# EasyEDA Pro project ProPrj_辉光管时钟-END_2025-01-18.epro

# Schematic Schematic1
Create Date: 2024-02-25; Page Name: P1; Project Name: 辉光管时钟-END; Schematic Name: Schematic1; Update Date: 2024-07-03; Company: 嘉立创EDA; Page Size: A4; Version: V1.0
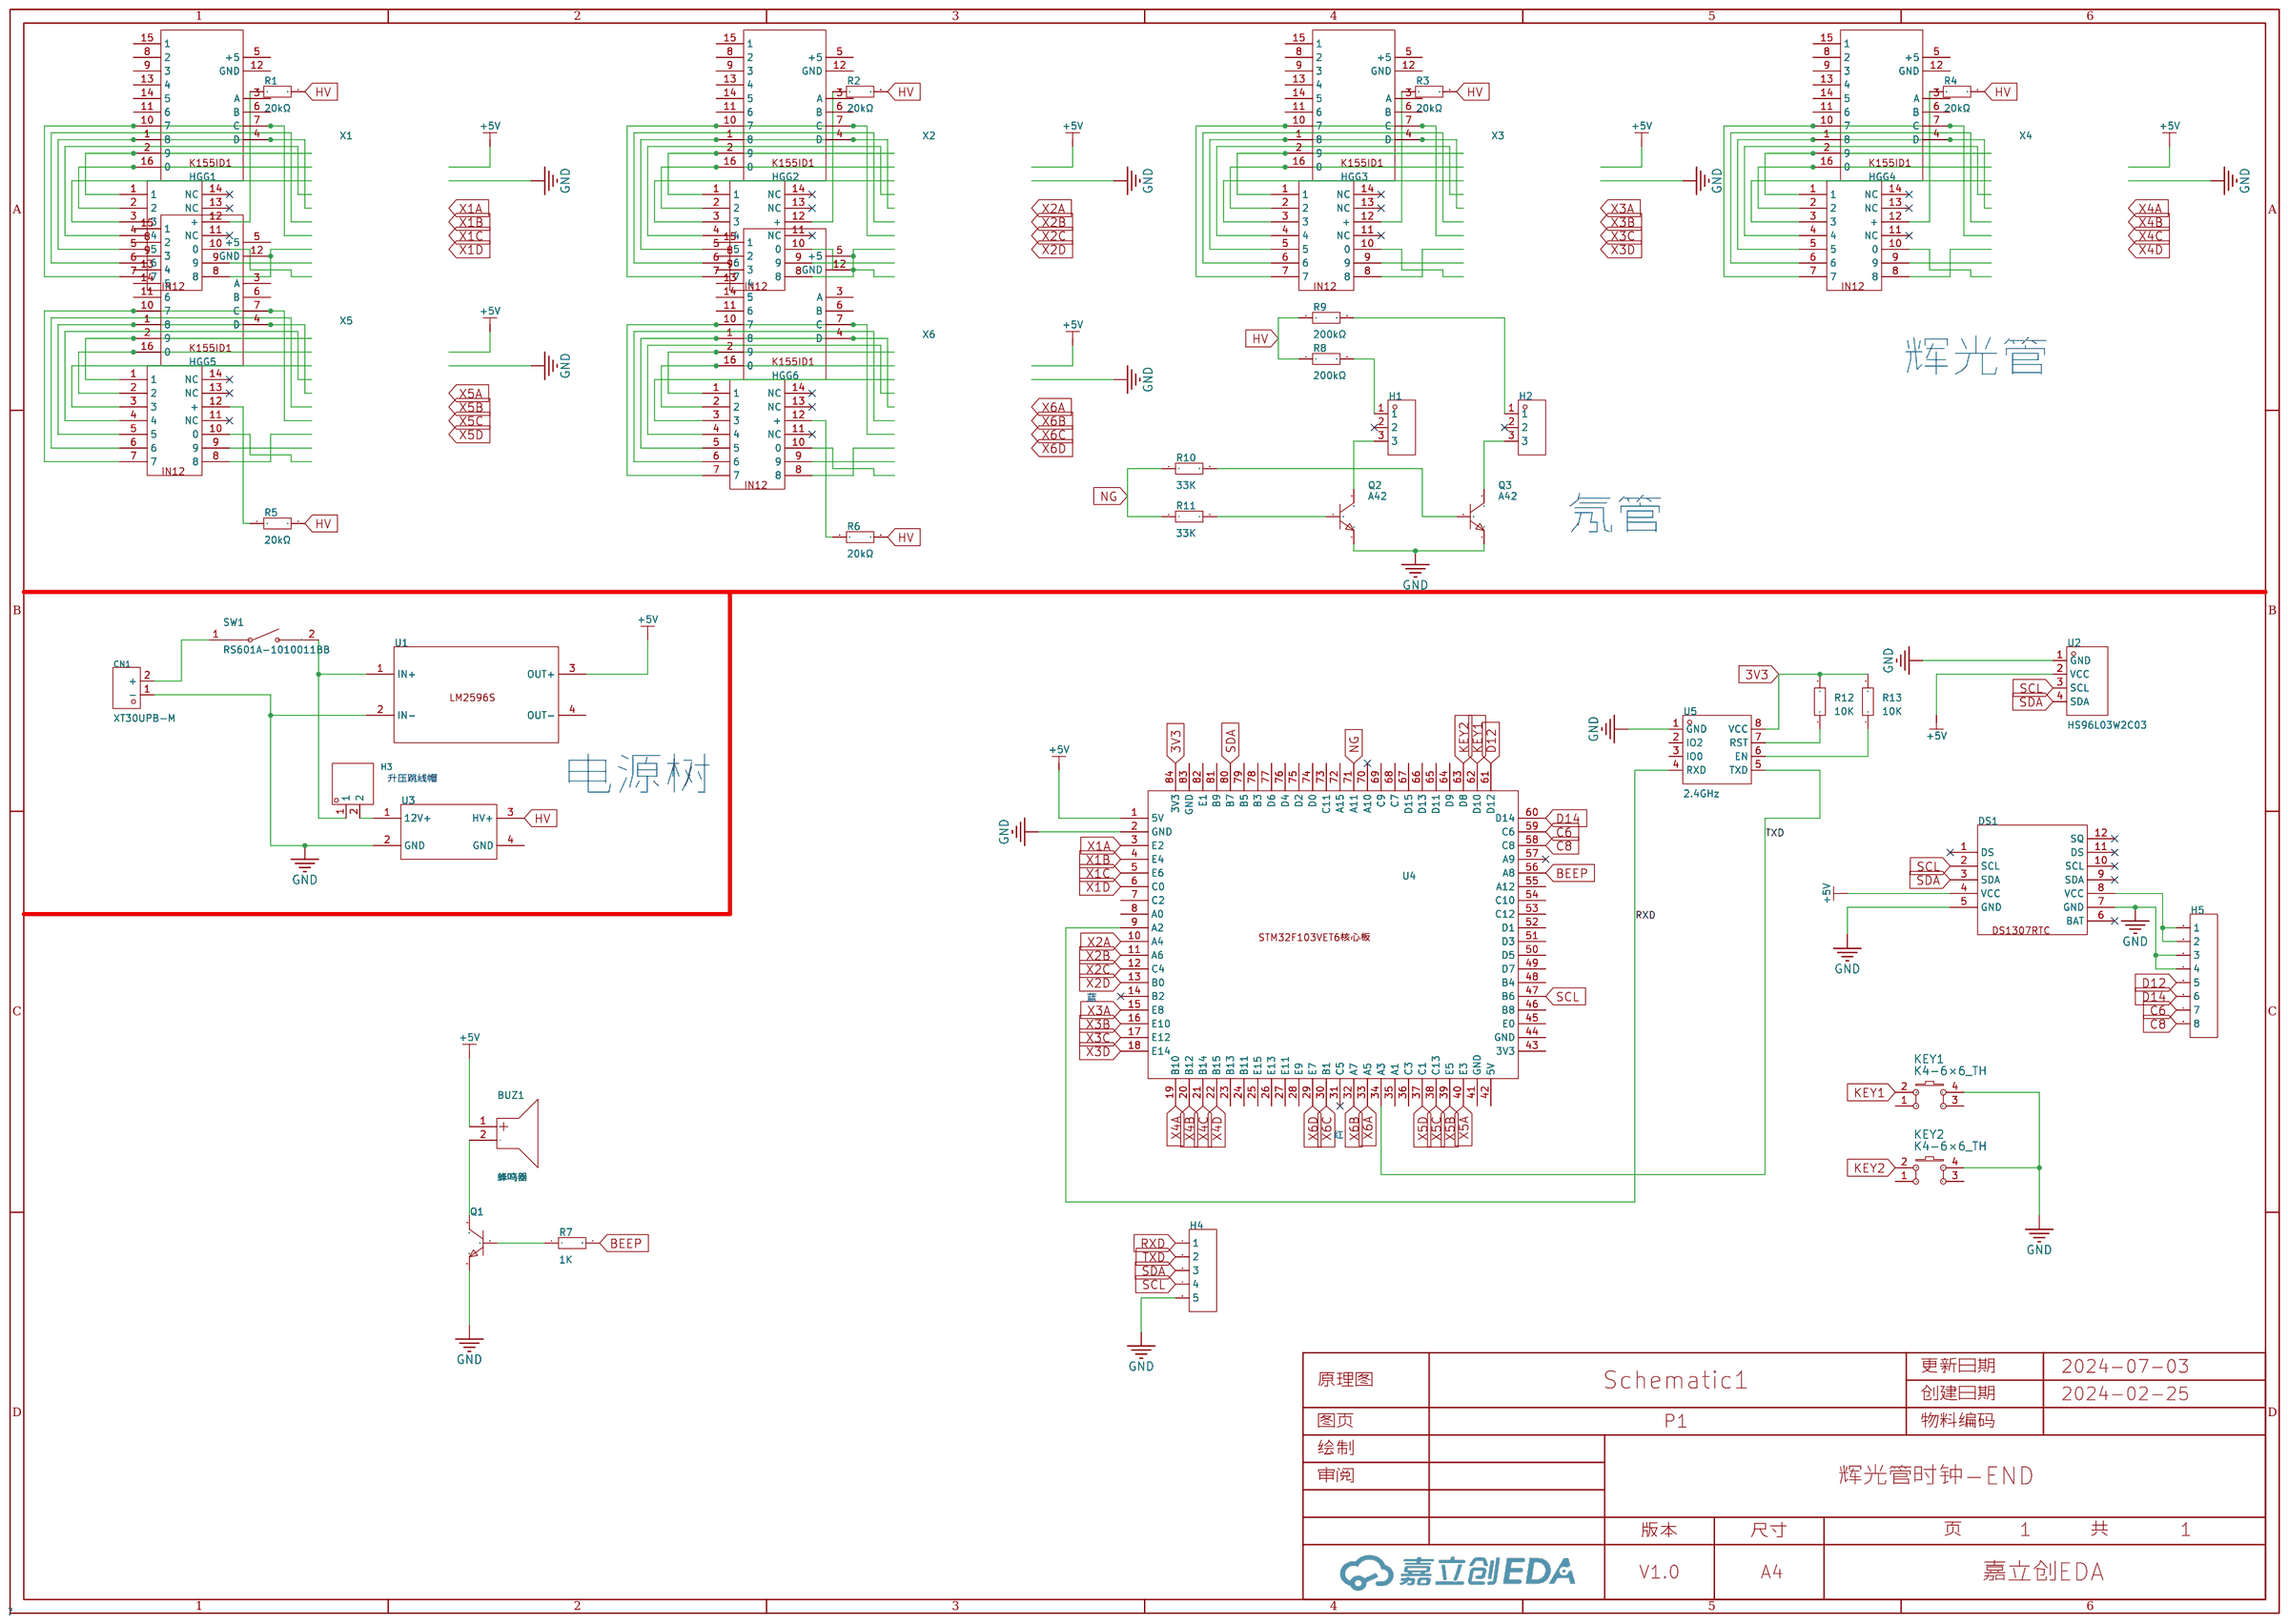
[diagram p0: schematic sheet]

## Parts
BUZ1  蜂鸣器  [BUZ-TH_BD9.0-P5.00-D0.6-FD]
CN1  XT30UPB-M  [CONN-TH_XT30UPB-M]
DS1  -  [Tiny RTC]
H1  -  [HDR-TH_3P-P2.54-V-F]
H2  -  [HDR-TH_3P-P2.54-V-F]
H3  -  [HDR-TH_2P-P2.54-V-M-1]
H4  -  [HDR-TH_5P-P2.54-V-F]
H5  -  [HDR-TH_8P-P2.54-V-F-1]
HGG1  -  [IN12-6]
HGG2  -  [IN12-6]
HGG3  -  [IN12-6]
HGG4  -  [IN12-6]
HGG5  -  [IN12-6]
HGG6  -  [IN12-6]
KEY1  K4-6×6_TH  [KEY-TH_4P-L6.0-W6.0-P4.50-LS6.5]
KEY2  K4-6×6_TH  [KEY-TH_4P-L6.0-W6.0-P4.50-LS6.5]
Q1  -  [S8050_SOT-23]
Q2  A42  [TO-92-3_L5.1-W4.1-P1.27-L]
Q3  A42  [TO-92-3_L5.1-W4.1-P1.27-L]
R1  20kΩ  [RES-TH_BD2.2-L6.5-P10.50-D0.6]
R2  20kΩ  [RES-TH_BD2.2-L6.5-P10.50-D0.6]
R3  20kΩ  [RES-TH_BD2.2-L6.5-P10.50-D0.6]
R4  20kΩ  [RES-TH_BD2.2-L6.5-P10.50-D0.6]
R5  20kΩ  [RES-TH_BD2.2-L6.5-P10.50-D0.6]
R6  20kΩ  [RES-TH_BD2.2-L6.5-P10.50-D0.6]
R7  1K  [R0805]
R8  200kΩ  [Res_1/4W]
R9  200kΩ  [Res_1/4W]
R10  33K  [R0805]
R11  33K  [R0805]
R12  10K  [R0805]
R13  10K  [R0805]
SW1  RS601A-1010011BB  [SW-TH_RS601A-1010011BB]
U1  -  [LM2596S降压模块]
U2  HS96L03W2C03  [OLED-TH_L27.8-W27.2-P2.54_C9900033791]
U3  -  [升压模块2]
U4  -  [魔女STM32F103VET6核心板]
U5  2.4GHz  [WIFIM-TH_8P-L24.7-W14.4-P2.54]
X1  -  [K155ID1]
X2  -  [K155ID1]
X3  -  [K155ID1]
X4  -  [K155ID1]
X5  -  [K155ID1]
X6  -  [K155ID1]

## Library data of the parts
BUZ1 = 蜂鸣器: Supplier Part: C9900020875; Supplier Footprint: 插件; JLCPCB Part Class: 扩展库; Supplier: LCSC
CN1 = XT30UPB-M: 类别:-;类型1:-;; LCSC Part Name: AMASS(艾迈斯)板载立式 航模锂电池控制器连接器插头 公头XT30UPB-M; Supplier Part: C428721; Manufacturer: AMASS(艾迈斯); JLCPCB Part Class: 扩展库; Datasheet: https://atta.szlcsc.com/upload/public/pdf/source/20230412/7B5DFEF57C9EA5273853390C734B3AC5.pdf; Supplier: LCSC; Brand: 艾迈斯; Type: 航模插头; Colour: 黄色; RatedVoltage: DC 500V; InterfaceType: 公头; MetalMaterial: 镀金; InsulationMaterial: PA; RatedCurrent: 15A; contact resistance: 0.65mΩ
DS1 = DS1307模块IIC: DS1307模块
H1 H2 = HDR-F_2.54_1x3P: Supplier Part: C541850; Supplier Footprint: 插件
H3 = HDR-M_2.54_1x2P: Supplier Part: C124375; Supplier Footprint: 插件
H4 = HDR-F_2.54_1x5P: Supplier Part: C50950; Supplier Footprint: 插件
H5 = HDR-F_2.54_1x8P: Supplier Part: C27438; Supplier Footprint: 插件
HGG1-HGG6 = 辉光管IN12
KEY1 KEY2 = K4-6×6_TH: link: https://item.szlcsc.com/111374.html; Supplier: LCSC; Supplier Part: C136684; Manufacturer: 韩国韩荣; Manufacturer Part: K2-1102DP-E4SW-04
Q1 = S8050_SOT_NPN: Supplier Footprint: SOT-23
Q2 Q3 = A42: 晶体管类型:NPN;集电极电流(Ic):200mA;集射极击穿电压(Vceo):305V;功率(Pd):625mW;直流电流增益(hFE@Ic,Vce):100@10mA,10V;; LCSC Part Name: A42(RANGE:100-200) B档（100-200）; Supplier Part: C28408; Manufacturer: CJ(江苏长电/长晶); Supplier Footprint: TO-92-3; JLCPCB Part Class: Extended Part; Datasheet: https://atta.szlcsc.com/upload/public/pdf/source/20151024/1457707487139.pdf; Supplier: LCSC; Transistor Type: NPN; Collector Current (Ic): 200mA; Collector-Emitter Breakdown Voltage (Vceo): 305V; Power Dissipation (Pd): 625mW; DC Current Gain (hFE@Ic,Vce): 100@10mA,10V; Transition Frequency (fT): 50MHz; Collector Cut-Off Current (Icbo): 250nA; Collector-Emitter Saturation Voltage (VCE(sat)@Ic,Ib): 200mV@20mA,2mA
R1-R6 = MFR0W4F2002A50: 电阻类型:金属膜电阻;阻值:20kΩ;精度:±1%;功率:250mW;温度系数:±50ppm/℃;; LCSC Part Name: 20kΩ ±1% 250mW 金属膜电阻; Supplier Part: C58594; Manufacturer: UNI-ROYAL(厚声); Supplier Footprint: 插件,D2.2xL6.5mm; JLCPCB Part Class: 扩展库; Datasheet: https://atta.szlcsc.com/upload/public/pdf/source/20191012/C436293_8820AA14BC71FA35E551C06C441482A0.pdf; Supplier: LCSC; Type: 金属膜电阻; Tolerance: ±1%; Overload Voltage (Max): 250V; Power(Watts): 250mW; Temperature Coefficient: ±50ppm/℃
R7 R10-R13 = Res_0805: Supplier Footprint: 0805
R8 R9 = Res_AXIAL-1/4W: Supplier Footprint: 轴向引线
SW1 = RS601A-1010011BB: Supplier Part: C883003; Manufacturer: LECI(乐磁); Supplier Footprint: 插件; JLCPCB Part Class: 扩展库; Datasheet: https://atta.szlcsc.com/upload/public/pdf/source/20201029/C883003_B485C30933EC2A673609346EE1934526.pdf; Supplier: LCSC
U1 = LM2569S降压模块
U2 = HS96L03W2C03: 主控芯片:SSD1315;接口类型:I2C;尺寸(inch):0.96;像素分辨率:128x64;; LCSC Part Name: 0.96寸OLED显示屏窄白光IIC; Supplier Part: C5248080; Manufacturer: HS(汉昇); JLCPCB Part Class: 扩展库; Datasheet: https://atta.szlcsc.com/upload/public/pdf/source/20230627/763D01F79A90007632F098068C7C8AD9.pdf; Supplier: LCSC; Main Control Chip: SSD1315; Interface Type: I2C; Size: 0.96; Pixel Resolution: 128x64; Operating Temperature: -40℃~+70℃
U3 = 辉光管升压模块: 给辉光管升压的模块
U4 = 魔女STM32F103VET6核心板
U5 = ESP-01S: 核心处理器:ESP8266芯片;频率:2.4GHz;天线形式:板载PCB天线;发射功率:16dBm;接收灵敏度:-90dBm;; LCSC Part Name: 完整的802.11b/g/nWi-FiSoC模块; Supplier Part: C503582; Manufacturer: Ai-Thinker(安信可); JLCPCB Part Class: 扩展库; Datasheet: https://atta.szlcsc.com/upload/public/pdf/source/20200407/C503582_1139AF8FB42E05635FA0089E1752A536.pdf; Supplier: LCSC; Core Processor: ESP8266芯片; Support Interface: GPIO；UART；PWM; Antenna Type: 板载PCB天线; Output Power: 16dBm; Operating Voltage: 3V~3.6V; Receive  Current: 56mA; Send  Current: 170mA; Sensitivity: -90dBm; Operating Temperature: -20℃~+70℃
X1-X6 = K155ID1

## Nets
3V3: R12.2 R13.2 U4.84(3V3) U5.8(VCC)
+5V: BUZ1.1(+) DS1.4(VCC) U1.3(OUT+) U2.2(VCC) U4.1(5V)
GND: CN1.1(-) DS1.5(GND) DS1.7(GND) H4.5 H5.3 H5.4 KEY1.4 KEY2.4 Q1.2 Q2.1(E) Q3.1(E) U1.2(IN-) U2.1(GND) U3.2(GND) U4.2(GND) U5.1(GND)
BEEP: R7.2 U4.56(A8)
C6: H5.7 U4.59(C6)
C8: H5.8 U4.58(C8)
D12: H5.5 U4.61(D12)
D14: H5.6 U4.60(D14)
HV: R1.2 R2.2 R3.2 R4.2 R5.2 R6.2 R8.1 R9.1 U3.3(HV+)
KEY1: KEY1.2 U4.62(D10)
KEY2: KEY2.2 U4.63(D8)
NG: R10.1 R11.1 U4.71(A11)
RXD: H4.1 U4.9(A2) U5.4(RXD)
SCL: DS1.2(SCL) H4.4 U2.3(SCL) U4.47(B6)
SDA: DS1.3(SDA) H4.3 U2.4(SDA) U4.80(B7)
TXD: H4.2 U4.34(A3) U5.5(TXD)
X1A: U4.3(E2)
X1B: U4.4(E4)
X1C: U4.5(E6)
X1D: U4.6(C0)
X2A: U4.10(A4)
X2B: U4.11(A6)
X2C: U4.12(C4)
X2D: U4.13(B0)
X3A: U4.15(E8)
X3B: U4.16(E10)
X3C: U4.17(E12)
X3D: U4.18(E14)
X4A: U4.19(B10)
X4B: U4.20(B12)
X4C: U4.21(B14)
X4D: U4.22(B15)
X5A: U4.40(E3)
X5B: U4.39(E5)
X5C: U4.38(C13)
X5D: U4.37(C1)
X6A: U4.33(A5)
X6B: U4.32(A7)
X6C: U4.30(B1)
X6D: U4.29(E7)
$1N6405: HGG1.12(+) R1.1
$1N6464: HGG2.12(+) R2.1
$1N6515: HGG3.12(+) R3.1
$1N6566: HGG4.12(+) R4.1
$1N6696: HGG5.12(+) R5.1
$1N6744: HGG6.12(+) R6.1
$1N7322: CN1.2(+) SW1.1
$1N11180: BUZ1.2(-) Q1.3
$1N11187: Q1.1 R7.1
$1N11430: H1.3 Q2.3(C)
$1N11434: H2.3 Q3.3(C)
$1N11486: H2.1 R9.2
$1N11490: H1.1 R8.2
$1N11585: Q2.2(B) R11.2
$1N11588: Q3.2(B) R10.2
$1N11682: H3.1 SW1.2 U1.1(IN+)
$1N11688: H3.2 U3.1(12V+)
$1N11859: R12.1 U5.7(RST)
$1N11862: R13.1 U5.6(EN)
$1N17522: DS1.8(VCC) H5.1 H5.2
Net-(HGG1-1): HGG1.1 X1.2(9)
Net-(HGG1-2): HGG1.2 X1.16(0)
Net-(HGG1-5): HGG1.5 X1.1(8) X1.4(D)
Net-(HGG1-7): HGG1.7 X1.7(C) X1.10(7)
Net-(HGG1-8): HGG1.8 X5.12(GND)
Net-(HGG2-1): HGG2.1 X2.2(9)
Net-(HGG2-2): HGG2.2 X2.16(0)
Net-(HGG2-5): HGG2.5 X2.1(8) X2.4(D)
Net-(HGG2-7): HGG2.7 X2.7(C) X2.10(7)
Net-(HGG2-8): HGG2.8 HGG2.10(0) X6.5(+5) X6.12(GND)
Net-(HGG3-1): HGG3.1 X3.2(9)
Net-(HGG3-2): HGG3.2 X3.16(0)
Net-(HGG3-5): HGG3.5 X3.1(8) X3.4(D)
Net-(HGG3-7): HGG3.7 X3.7(C) X3.10(7)
Net-(HGG4-1): HGG4.1 X4.2(9)
Net-(HGG4-2): HGG4.2 X4.16(0)
Net-(HGG4-5): HGG4.5 X4.1(8) X4.4(D)
Net-(HGG4-7): HGG4.7 X4.7(C) X4.10(7)
Net-(HGG5-1): HGG5.1 X5.2(9)
Net-(HGG5-2): HGG5.2 X5.16(0)
Net-(HGG5-5): HGG5.5 X5.1(8) X5.4(D)
Net-(HGG5-7): HGG5.7 X5.7(C) X5.10(7)
Net-(HGG6-1): HGG6.1 X6.2(9)
Net-(HGG6-2): HGG6.2 X6.16(0)
Net-(HGG6-5): HGG6.5 X6.1(8) X6.4(D)
Net-(HGG6-7): HGG6.7 X6.7(C) X6.10(7)

Not connected (* = marked no-connect by the designer): DS1 1(DS)* 6(BAT)* 9(SDA)* 10(SCL)* 11(DS)* 12(SQ)*; H1 2*; H2 2*; HGG1 3 4 6 9 10(0) 11(NC)* 13(NC)* 14(NC)*; HGG2 3 4 6 9 11(NC)* 13(NC)* 14(NC)*; HGG3 3 4 6 8 9 10(0) 11(NC)* 13(NC)* 14(NC)*; HGG4 3 4 6 8 9 10(0) 11(NC)* 13(NC)* 14(NC)*; HGG5 3 4 6 8 9 10(0) 11(NC)* 13(NC)* 14(NC)*; HGG6 3 4 6 8 9 10(0) 11(NC)* 13(NC)* 14(NC)*; KEY1 1 3; KEY2 1 3; U1 4(OUT-); U3 4(GND); U4 7(C2) 8(A0) 14(B2)* 23(B13) 24(B11) 25(E15) 26(E13) 27(E11) 28(E9) 31(C5)* 35(A1) 36(C3) 41(GND) 42(5V) 43(3V3) 44(GND) 45(E0) 46(B8) 48(B4) 49(D7) 50(D5) 51(D3) 52(D1) 53(C12) 54(C10) 55(A12) 57(A9)* 64(D9) 65(D11) 66(D13) 67(D15) 68(C7) 69(C9) 70(A10)* 72(A15) 73(C11) 74(D0) 75(D2) 76(D4) 77(D6) 78(B3) 79(B5) 81(B9) 82(E1) 83(GND); U5 2(IO2) 3(IO0); X1 3(A) 5(+5) 6(B) 8(2) 9(3) 11(6) 12(GND) 13(4) 14(5) 15(1); X2 3(A) 5(+5) 6(B) 8(2) 9(3) 11(6) 12(GND) 13(4) 14(5) 15(1); X3 3(A) 5(+5) 6(B) 8(2) 9(3) 11(6) 12(GND) 13(4) 14(5) 15(1); X4 3(A) 5(+5) 6(B) 8(2) 9(3) 11(6) 12(GND) 13(4) 14(5) 15(1); X5 3(A) 5(+5) 6(B) 8(2) 9(3) 11(6) 13(4) 14(5) 15(1); X6 3(A) 6(B) 8(2) 9(3) 11(6) 13(4) 14(5) 15(1)

## Notes on the sheet
- 辉光管
- 氖管
- 升压跳线帽
- 电源树
- 蓝
- 红

# Board PCB2
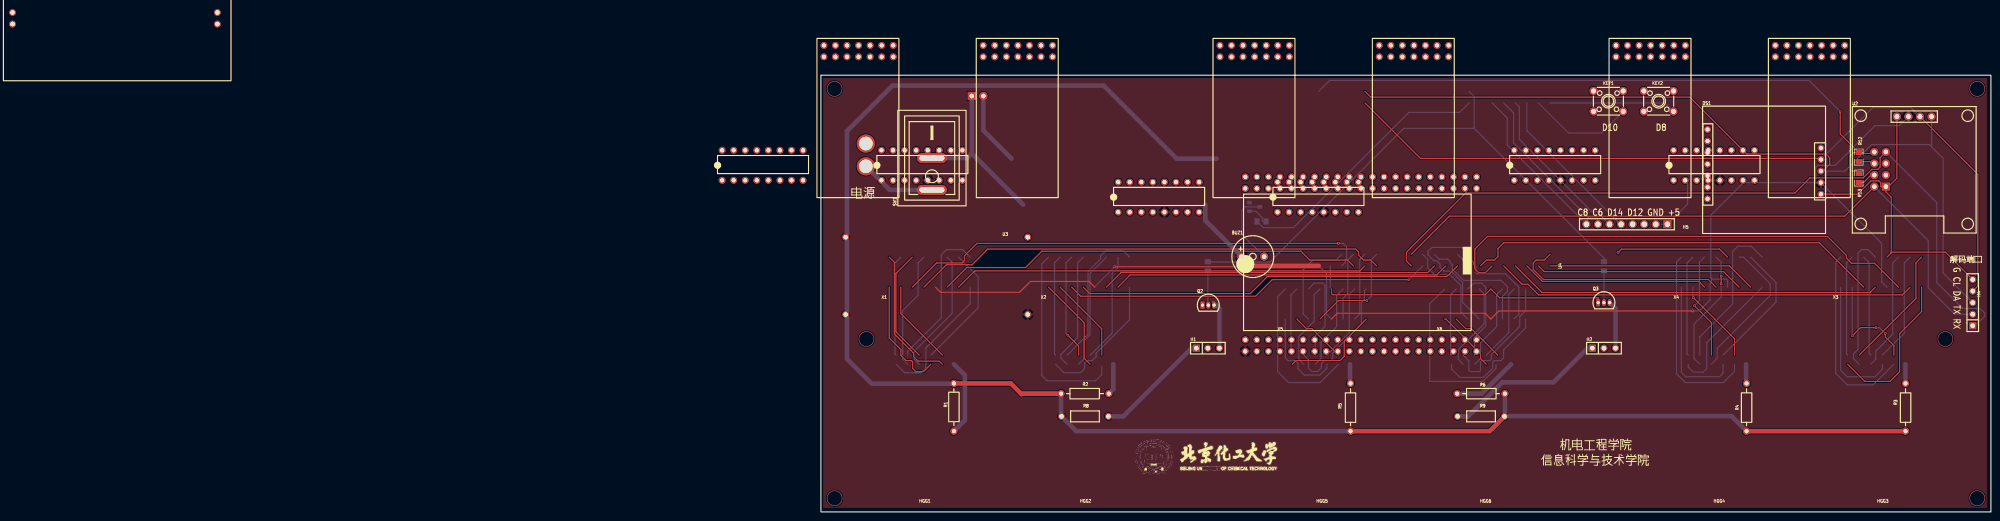
[diagram p1: board, top side]
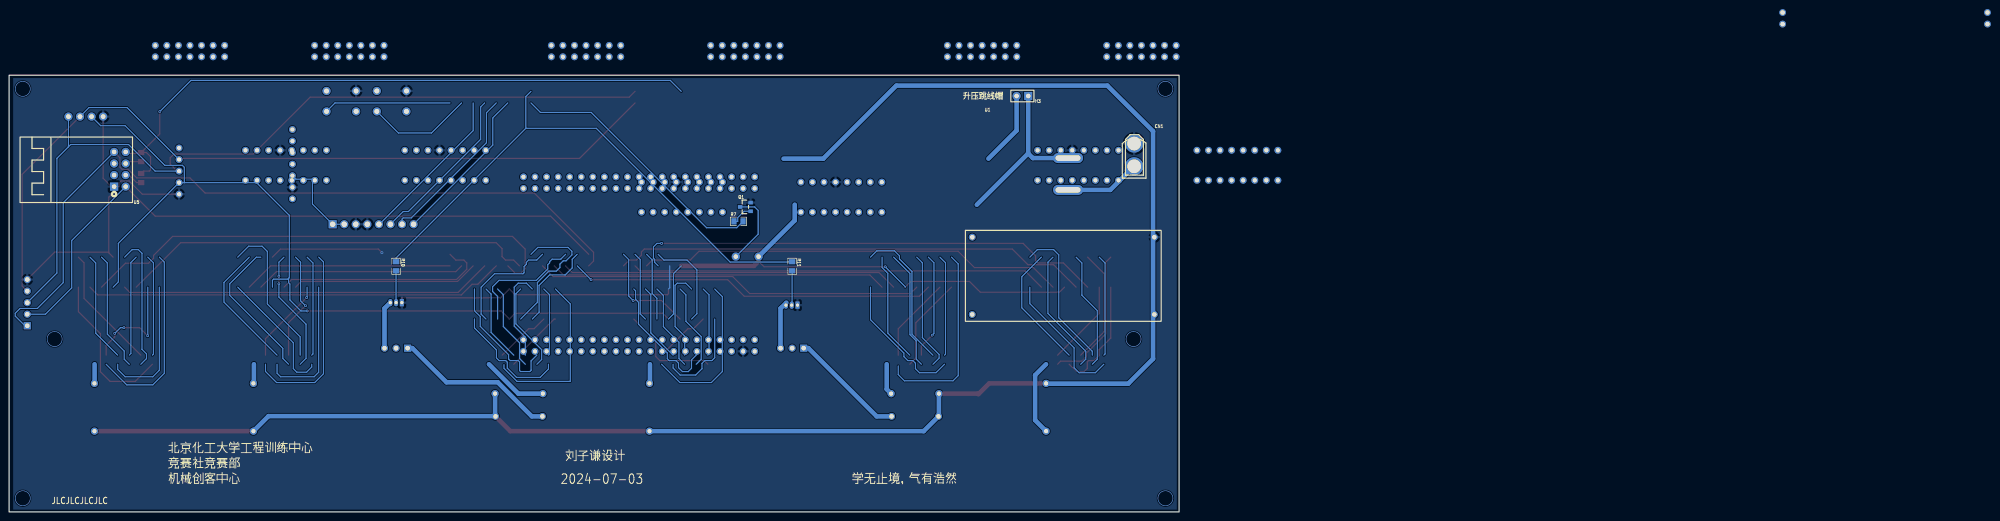
[diagram p2: board, bottom side, seen from below]

Outline 257 x 96 mm; copper layers: Top Layer, Bottom Layer. Coordinates in mm from the lower left corner of the outline.
Outline path: rectangle 0,96 257,0
Stack: Top Layer 0.035mm / Dielectric1 1.51mm FR4 er 4.5 / Bottom Layer 0.035mm

## Design rules (mm)
template: JLCPCB Capability(Two Layers Board)
spacing copperThickness1oz (default): track to track 0.102, other pairs 0.152 to 0.3
spacing copperThickness2oz: track to track 0.203, other pairs 0.152 to 0.3
track width copperThickness1oz (default): min 0.127, default 0.254, max 2.54
track width copperThickness2oz: min 0.203, default 0.254, max 2.54
differential pair differentialPair (default): width min 0.127, default 0.254, max 2.54; gap min 0.152, default 0.152
via viaSize (default): diameter min 0.5, default 0.61, max 10; hole min 0.3, default 0.305, max 6.3

## Placement (name value [footprint] x y rotation side)
BUZ1  蜂鸣器  [BUZ-TH_BD9.0-P5.00-D0.6-FD]  94.87 56.12 0 top
CN1  XT30UPB-M  [conn-th_xt30upb-m]  9.87 78.47 270 bottom
DS1  -  [Tiny RTC]  207.52 74.79 0 top
H1  -  [HDR-TH_3P-P2.54-V-F]  85 36 0 top
H2  -  [HDR-TH_3P-P2.54-V-F]  172 36 0 top
H3  -  [HDR-TH_2P-P2.54-V-M-1]  34.42 91.43 0 bottom
H4  -  [HDR-TH_5P-P2.54-V-F]  253.01 46 90 top
H5  -  [HDR-TH_8P-P2.54-V-F-1]  177.04 63.23 180 top
HGG1  -  [IN12-6]  15 36 0 top
HGG2  -  [IN12-6]  50 36 0 top
HGG3  -  [IN12-6]  224 36 0 top
HGG4  -  [IN12-6]  189 36 0 top
HGG5  -  [IN12-6]  102 36 0 top
HGG6  -  [IN12-6]  137 36 0 top
KEY1  K4-6×6_TH  [KEY-TH_4P-L6.0-W6.0-P4.50-LS6.5]  172.97 90.28 0 top
KEY2  K4-6×6_TH  [KEY-TH_4P-L6.0-W6.0-P4.50-LS6.5]  184.02 90.28 0 top
Q1  -  [S8050_SOT-23]  95.27 66.92 180 bottom
Q2  A42  [TO-92-3_L5.1-W4.1-P1.27-L]  85.09 45.45 0 top
Q3  A42  [TO-92-3_L5.1-W4.1-P1.27-L]  172 46 0 top
R1  20kΩ  [RES-TH_BD2.2-L6.5-P10.50-D0.6]  29.21 23 90 top
R2  20kΩ  [RES-TH_BD2.2-L6.5-P10.50-D0.6]  58 26 180 top
R3  20kΩ  [RES-TH_BD2.2-L6.5-P10.50-D0.6]  238.25 23 270 top
R4  20kΩ  [RES-TH_BD2.2-L6.5-P10.50-D0.6]  203.33 23 270 top
R5  20kΩ  [RES-TH_BD2.2-L6.5-P10.50-D0.6]  116.33 23 270 top
R6  20kΩ  [RES-TH_BD2.2-L6.5-P10.50-D0.6]  145 26 0 top
R7  1K  [R0805]  96.77 63.87 180 bottom
R8  200kΩ  [Res_1/4W]  58 21 0 top
R9  200kΩ  [Res_1/4W]  145 21 180 top
R10  33K  [R0805]  172 54 270 bottom
R11  33K  [R0805]  85 54 270 bottom
R12  10K  [R0805]  228 78 90 top
R13  10K  [R0805]  228 73.39 90 top
SW1  RS601A-1010011BB  [SW-TH_RS601A-1010011BB]  24.38 74.28 90 top
U1  -  [LM2596S降压模块]  42.93 66.03 0 bottom
U2  HS96L03W2C03  [OLED-TH_L27.8-W27.2-P2.54_C9900033791]  240.16 86.9 0 top
U3  -  [升压模块2]  39.88 89.65 0 top
U4  -  [魔女STM32F103VET6核心板]  109.35 54.09 90 top
U5  2.4GHz  [WIFIM-TH_8P-L24.7-W14.4-P2.54]  232.66 75.32 0 bottom
X1  -  [K155ID1]  15 56 0 top
X2  -  [K155ID1]  50 56 0 top
X3  -  [K155ID1]  224 56 0 top
X4  -  [K155ID1]  189 56 0 top
X5  -  [K155ID1]  102 49 0 top
X6  -  [K155ID1]  137 49 0 top

## Footprints (pads in the part's own frame, mm; a bottom-side part is the same pattern mirrored in y, then rotated)
BUZ-TH_BD9.0-P5.00-D0.6-FD
  round 1.8 hole 1: 1(-2.5,0) 2(2.5,0)
conn-th_xt30upb-m
  round 4 hole 3: 1(-2.5,0) 2(2.5,0)
HDR-TH_2P-P2.54-V-M-1
  rect 1.8x1.8 hole 1: 1(-1.27,0)
  round 1.8 hole 1: 2(1.27,0)
HDR-TH_3P-P2.54-V-F
  rect 1.575x1.575 hole 1.02: 1(-2.54,0)
  round 1.575 hole 1.02: 2(0,0) 3(2.54,0)
HDR-TH_5P-P2.54-V-F
  rect 1.575x1.575 hole 1.02: 1(-5.08,0)
  round 1.575 hole 1.02: 2(-2.54,0) 3(0,0) 4(2.54,0) 5(5.08,0)
HDR-TH_8P-P2.54-V-F-1
  rect 1.8x1.8 hole 1.2: 1(-8.89,0)
  round 1.8 hole 1.2: 2(-6.35,0) 3(-3.81,0) 4(-1.27,0) 5(1.27,0) 6(3.81,0) 7(6.35,0) 8(8.89,0)
IN12-6
  round 1.524 hole 0.914: 1(-14.351,66.548) 2(-14.351,64.04) 3(-11.811,66.548) 4(-11.811,64.04) 5(-9.271,66.548) 6(-9.271,64.04) 7(-6.731,66.548) 8(-6.731,64.04) 9(-4.191,66.548) 10(-4.191,64.04) 11(-1.651,66.548) 12(-1.651,64.04) 13(0.889,66.548) 14(0.889,64.04)
K155ID1
  round 1.524 hole 0.914: 1(-36.703,16.895) 2(-34.163,16.895) 3(-31.623,16.895) 4(-29.083,16.895) 5(-26.543,16.895) 6(-24.003,16.895) 7(-21.463,16.895) 8(-18.923,16.895) 9(-18.923,23.495) 10(-21.463,23.495) 11(-24.003,23.495) 12(-26.543,23.495) 13(-29.083,23.495) 14(-31.623,23.495) 15(-34.163,23.495) 16(-36.703,23.495)
KEY-TH_4P-L6.0-W6.0-P4.50-LS6.5
  round 1.8 hole 1.1: 1(-3.251,-2.251) 2(3.251,-2.251) 3(3.251,2.251) 4(-3.251,2.251)
LM2596S降压模块
  round 1.524 hole 1: 1(-37.489,22.63) 2(-37.489,5.63) 3(2.511,22.63) 4(2.511,5.63)
OLED-TH_L27.8-W27.2-P2.54_C9900033791
  round 1.8 hole 1.05: 1(-3.81,0) 2(-1.27,0) 3(1.27,0) 4(3.81,0)
R0805
  rect 1.133x1.377 smd: 1(-1,0) 2(1,0)
RES-TH_BD2.2-L6.5-P10.50-D0.6
  round 1.6 hole 0.914: 1(-5.25,0) 2(5.25,0)
Res_1/4W
  round 1.524 hole 1: 1(-5.15,0) 2(5.15,0)
S8050_SOT-23
  rect 1x0.8 smd: 1(1.15,-0.823) 2(1.15,1.077) 3(-1.15,0.127)
SW-TH_RS601A-1010011BB
  oval 2.2x6.6 hole 1.2x5.5: 1(-3.5,0) 2(3.5,0)
Tiny RTC
  round 1.524 hole 0.914: 1(12.141,5.207) 2(12.141,2.667) 3(12.141,0.127) 4(12.141,-2.413) 5(12.141,-4.953) 6(-12.751,-5.969) 7(-12.751,-3.429) 8(-12.751,-0.889) 9(-12.751,1.651) 10(-12.751,4.191) 11(-12.751,6.731) 12(-12.751,9.271)
TO-92-3_L5.1-W4.1-P1.27-L
  rect 0.9x1.6 hole 0.7: 1(-1.27,0)
  oval 0.9x1.6 hole 0.7: 2(0,0) 3(1.27,0)
WIFIM-TH_8P-L24.7-W14.4-P2.54
  rect 1.8x1.8 hole 1: 1(1.27,3.81)
  round 1.8 hole 1: 2(1.27,1.27) 3(1.27,-1.27) 4(1.27,-3.81) 5(-1.27,3.81) 6(-1.27,1.27) 7(-1.27,-1.27) 8(-1.27,-3.81)
升压模块2
  round 1.5 hole 1: 1(-217.456,20.131) 2(-217.456,17.591) 3(-172.456,20.131) 4(-172.456,17.591)
魔女STM32F103VET6核心板
  round 1.524 hole 0.914: 1(-18.796,16.129) 2(-18.796,13.589) 3(-18.796,11.049) 4(-18.796,8.509) 5(-18.796,5.969) 6(-18.796,3.429) 7(-18.796,0.889) 8(-18.796,-1.651) 9(-18.796,-4.191) 10(-18.796,-6.731) 11(-18.796,-9.271) 12(-18.796,-11.811) 13(-18.796,-14.351) 14(-18.796,-16.891) 15(-18.796,-19.431) 16(-18.796,-21.971) 17(-18.796,-24.511) 18(-18.796,-27.051) 19(-18.796,-29.591) 20(-18.796,-32.131) 21(-18.796,-34.671) 22(-16.256,-34.671) 23(-16.256,-32.131) 24(-16.256,-29.591) 25(-16.256,-27.051) 26(-16.256,-24.511) 27(-16.256,-21.971) 28(-16.256,-19.431) 29(-16.256,-16.891) 30(-16.256,-14.351) 31(-16.256,-11.811) 32(-16.256,-9.271) 33(-16.256,-6.731) 34(-16.256,-4.191) 35(-16.256,-1.651) 36(-16.256,0.889) 37(-16.256,3.429) 38(-16.256,5.969) 39(-16.256,8.509) 40(-16.256,11.049) 41(-16.256,13.589) 42(-16.256,16.129) 43(17.018,16.129) 44(17.018,13.589) 45(17.018,11.049) 46(17.018,8.509) 47(17.018,5.969) 48(17.018,3.429) 49(17.018,0.889) 50(17.018,-1.651) 51(17.018,-4.191) 52(17.018,-6.731) 53(17.018,-9.271) 54(17.018,-11.811) 55(17.018,-14.351) 56(17.018,-16.891) 57(17.018,-19.431) 58(17.018,-21.971) 59(17.018,-24.511) 60(17.018,-27.051) 61(17.018,-29.591) 62(17.018,-32.131) 63(17.018,-34.671) 64(19.558,-34.671) 65(19.558,-32.131) 66(19.558,-29.591) 67(19.558,-27.051) 68(19.558,-24.511) 69(19.558,-21.971) 70(19.558,-19.431) 71(19.558,-16.891) 72(19.558,-14.351) 73(19.558,-11.811) 74(19.558,-9.271) 75(19.558,-6.731) 76(19.558,-4.191) 77(19.558,-1.651) 78(19.558,0.889) 79(19.558,3.429) 80(19.558,5.969) 81(19.558,8.509) 82(19.558,11.049) 83(19.558,13.589) 84(19.558,16.129)

## Nets
3V3: R12.2 R13.2 U4.84 U5.8
+5V: BUZ1.1 DS1.4 U1.3 U2.2 U4.1 X1.5 X2.5 X3.5 X4.5 X5.5 X6.5
GND: CN1.1 DS1.5 DS1.7 H4.5 H5.3 H5.4 KEY1.4 KEY2.4 Q1.2 Q2.1 Q3.1 U1.2 U2.1 U3.2 U4.2 U5.1 X1.12 X2.12 X3.12 X4.12 X5.12 X6.12
BEEP: R7.2 U4.56
C6: H5.7 U4.59
C8: H5.8 U4.58
D12: H5.5 U4.61
D14: H5.6 U4.60
HV: R1.2 R2.2 R3.2 R4.2 R5.2 R6.2 R8.1 R9.1 U3.3
KEY1: KEY1.2 U4.62
KEY2: KEY2.2 U4.63
MO: U4.55
NG: R10.1 R11.1 U4.71
RXD: H4.1 U4.9 U5.4
SCL: DS1.2 H4.4 U2.3 U4.47
SDA: DS1.3 H4.3 U2.4 U4.80
TXD: H4.2 U4.34 U5.5
X1A: U4.3 X1.3
X1B: U4.4 X1.6
X1C: U4.5 X1.7
X1D: U4.6 X1.4
X2A: U4.10 X2.3
X2B: U4.11 X2.6
X2C: U4.12 X2.7
X2D: U4.13 X2.4
X3A: U4.15 X3.3
X3B: U4.16 X3.6
X3C: U4.17 X3.7
X3D: U4.18 X3.4
X4A: U4.19 X4.3
X4B: U4.20 X4.6
X4C: U4.21 X4.7
X4D: U4.22 X4.4
X5A: U4.40 X5.3
X5B: U4.39 X5.6
X5C: U4.38 X5.7
X5D: U4.37 X5.4
X6A: U4.33 X6.3
X6B: U4.32 X6.6
X6C: U4.30 X6.7
X6D: U4.29 X6.4
$1N4514: HGG1.1 X1.15
$1N4523: HGG1.2 X1.8
$1N4533: HGG1.3 X1.9
$1N4538: HGG1.4 X1.13
$1N4552: HGG1.5 X1.14
$1N4570: HGG1.6 X1.11
$1N4577: HGG1.7 X1.10
$1N4594: HGG1.8 X1.1
$1N4599: HGG1.9 X1.2
$1N4602: HGG1.10 X1.16
$1N4880: HGG2.1 X2.15
$1N4884: HGG2.2 X2.8
$1N4888: HGG2.3 X2.9
$1N4892: HGG2.4 X2.13
$1N4898: HGG2.5 X2.14
$1N4904: HGG2.6 X2.11
$1N4910: HGG2.7 X2.10
$1N4916: HGG2.8 X2.1
$1N4920: HGG2.9 X2.2
$1N4922: HGG2.10 X2.16
$1N5131: HGG3.1 X3.15
$1N5135: HGG3.2 X3.8
$1N5139: HGG3.3 X3.9
$1N5143: HGG3.4 X3.13
$1N5149: HGG3.5 X3.14
$1N5155: HGG3.6 X3.11
$1N5161: HGG3.7 X3.10
$1N5167: HGG3.8 X3.1
$1N5171: HGG3.9 X3.2
$1N5173: HGG3.10 X3.16
$1N5382: HGG4.1 X4.15
$1N5386: HGG4.2 X4.8
$1N5390: HGG4.3 X4.9
$1N5394: HGG4.4 X4.13
$1N5400: HGG4.5 X4.14
$1N5406: HGG4.6 X4.11
$1N5412: HGG4.7 X4.10
$1N5418: HGG4.8 X4.1
$1N5422: HGG4.9 X4.2
$1N5424: HGG4.10 X4.16
$1N5633: HGG5.1 X5.15
$1N5637: HGG5.2 X5.8
$1N5641: HGG5.3 X5.9
$1N5645: HGG5.4 X5.13
$1N5651: HGG5.5 X5.14
$1N5657: HGG5.6 X5.11
$1N5663: HGG5.7 X5.10
$1N5669: HGG5.8 X5.1
$1N5673: HGG5.9 X5.2
$1N5675: HGG5.10 X5.16
$1N5884: HGG6.1 X6.15
$1N5888: HGG6.2 X6.8
$1N5892: HGG6.3 X6.9
$1N5896: HGG6.4 X6.13
$1N5902: HGG6.5 X6.14
$1N5908: HGG6.6 X6.11
$1N5914: HGG6.7 X6.10
$1N5920: HGG6.8 X6.1
$1N5924: HGG6.9 X6.2
$1N5926: HGG6.10 X6.16
$1N6405: HGG1.12 R1.1
$1N6464: HGG2.12 R2.1
$1N6515: HGG3.12 R3.1
$1N6566: HGG4.12 R4.1
$1N6696: HGG5.12 R5.1
$1N6744: HGG6.12 R6.1
$1N7322: CN1.2 SW1.1
$1N11180: BUZ1.2 Q1.3
$1N11187: Q1.1 R7.1
$1N11430: H1.3 Q2.3
$1N11434: H2.3 Q3.3
$1N11486: H2.1 R9.2
$1N11490: H1.1 R8.2
$1N11585: Q2.2 R11.2
$1N11588: Q3.2 R10.2
$1N11682: H3.1 SW1.2 U1.1
$1N11688: H3.2 U3.1
$1N11859: R12.1 U5.7
$1N11862: R13.1 U5.6
$1N17522: DS1.8 H5.1 H5.2

Pads without a net: DS1 1 6 9 10 11 12; H1 2; H2 2; HGG1 11 13 14; HGG2 11 13 14; HGG3 11 13 14; HGG4 11 13 14; HGG5 11 13 14; HGG6 11 13 14; KEY1 1 3; KEY2 1 3; U1 4; U3 4; U4 7 8 14 23 24 25 26 27 28 31 35 36 41 42 43 44 45 46 48 49 50 51 52 53 54 57 64 65 66 67 68 69 70 72 73 74 75 76 77 78 79 81 82 83; U5 2 3

## Via types
v1: diameter 3.4, hole 3.2, Top Layer to Bottom Layer, 6 vias
v2: diameter 0.61, hole 0.305, Top Layer to Bottom Layer, 15 vias

## Routing (per net, layer and track width the routed paths; a pad name or vN(x,y) marks a point on that pad's centre or on a via; arc(x,y) is an arc through that point)
3V3: length 140.5
  Top Layer w0.254: R12.2 228.95,79 229.14,78.8 231.07,78.8 U5.8 ; R12.2 226.84,79 225.93,78.09 225.93,75.17 226.19,74.92 227.48,74.92 R13.2 ; R12.2 223.9,83.1 v2(223.9,88)
  Bottom Layer w0.254: v2(223.9,88) 217.04,94.86 111.76,94.86 109.35,92.44
+5V: length 312.1
  Top Layer w0.254: v2(64.54,53.89) 91.15,53.89 92.37,55.11 92.37,56.12 ; 25.16,49.4 26.28,48.29 43.65,48.29 46.02,50.66 58.9,50.66 60.16,49.4 ; 112.16,42.4 113.43,43.68 145.88,43.68 147.16,42.4 148.94,44.18 v2(191.52,44.18)
  Top Layer w1: 109.35,54.09 93.39,54.09 92.37,55.11
  Bottom Layer w0.254: 218.51,72.38 DS1.4 233.01,59.03 233.01,50.55 234.16,49.4 ; 218.51,72.38 218.51,75.75 218.95,76.19 222.8,76.19 231.52,84.9 236.89,84.9 U2.2 ; 218.51,72.38 202.63,72.38 195.45,65.2 195.45,51.49 195.61,51.33 ; 195.61,51.33 195.61,50.4 195.33,50.11 195.33,46.6 192.91,44.18 v2(191.52,44.18) ; 195.61,51.33 195.77,51.17 198.91,51.17 199.16,50.92 199.16,49.4 ; v2(64.54,53.89) 60.16,49.51 60.16,49.4 ; 109.35,54.09 111.07,52.37 111.07,43.49 112.16,42.4
  Bottom Layer w1: 84.43,67.53 84.43,64.06 92.37,56.12
GND: length 162.7
  Top Layer w0.254: 199.16,56 197.39,57.77 175.88,57.77 v2(175.1,57) ; DS1.5 227.73,69.84 230.65,72.76 232.41,72.76 232.78,72.39 232.78,71.51 U5.1 233.93,70.93 ; 112.16,49 112.16,47.98 112.4,47.74 145.9,47.74 147.16,49 149.11,47.06 170.73,47.06 170.73,46 ; 235.12,57.1 235.12,56.95 234.16,56 ; 235.12,57.1 246.99,57.1 253.01,51.08 ; 235.12,57.1 235.12,69.17 233.93,70.36 233.93,70.93 ; 233.93,70.93 236.35,73.35 U2.1
  Bottom Layer w0.254: 111.89,54.09 111.89,49.27 112.16,49
(no net):
  vias: v1(3,93) v1(3,3) v1(10,38) v1(247,38) v1(254,93) v1(254,3)
BEEP: length 58.5
  Bottom Layer w0.254: 142.37,89.9 140.28,87.82 129.13,87.82 103.78,62.47 97.17,62.47 95.77,63.87
C6: length 36.3
  Bottom Layer w0.254: H5.7 170.69,64.38 170.43,64.63 168.66,64.63 152.15,81.14 152.15,87.75 149.99,89.9
C8: length 35.2
  Bottom Layer w0.254: 147.45,89.9 150.75,86.6 150.75,80.63 H5.8
D12: length 35.3
  Bottom Layer w0.254: H5.5 175.64,63.23 155.07,83.81 155.07,89.9
D14: length 35.9
  Bottom Layer w0.254: 152.53,89.9 153.42,89.02 153.42,81.9 169.29,66.03 170.43,66.03 H5.6
HV: length 396.9
  Top Layer w1: R9.1 146.9,17.75 R5.2 ; R2.2 44.17,26 44.07,25.9 41.72,28.25 R1.2 ; R3.2 R4.2
  Bottom Layer w0.254: R9.1 150.2,21.05 150.25,21.05 ; R8.1 52.75,21.1 ; 52.75,21.1 R2.2
  Bottom Layer w1: R4.2 200.03,21.05 150.25,21.05 150.25,26 ; R1.2 29.14,28.18 11.18,28.18 5.71,33.64 5.71,83.68 15.75,93.71 62.1,93.71 78.17,77.65 86.88,77.65 ; R2.2 52.75,21.1 R8.1 56.1,17.75 R5.2
KEY1: length 23.3
  Bottom Layer w0.254: KEY1.2 171.49,83.3 164.21,83.3 157.61,89.9
KEY2: length 27.9
  Bottom Layer w0.254: KEY2.2 185.41,89.9 160.15,89.9
NG: length 120.4
  Bottom Layer w0.254: 143.49,84.33 128.02,84.33 98.61,54.92 86.02,54.92 85.95,55 R11.1 ; 143.49,84.33 172,55.82 R10.1 ; 143.49,84.33 143.49,91.32 142.37,92.44
RXD: length 169.9
  Top Layer w0.254: U5.4 232.66,77.86 232.66,75.81 232.16,75.3 230.84,75.3 228.96,73.42 217.26,73.42 213.93,70.09 141.64,70.09 128.62,57.08 128.62,55.14 129.67,54.09
  Bottom Layer w0.254: U5.4 245.11,67.95 245.11,50.41 250.79,44.73 254.6,44.73 255.65,43.68 255.65,43.04 253.52,40.92 253.01,40.92
SCL: length 176.7
  Top Layer w0.254: 119.51,89.9 131.7,77.71 219.41,77.71 DS1.2 ; 241.43,86.9 254.13,74.2 254.13,49.66 253.01,48.54
  Bottom Layer w0.254: 241.43,86.9 239.44,88.89 231.09,88.89 DS1.2
SDA: length 183.7
  Top Layer w0.254: 119.51,92.44 120.78,91.17 190.87,91.17 203.37,78.67 220.78,78.67 221.62,77.84 221.62,76.44 220.09,74.92 DS1.3
  Bottom Layer w0.254: 253.01,46 246.51,52.5 246.51,77.72 243.97,80.26 ; 243.97,80.26 243.47,80.76 230.76,80.76 224.92,74.92 DS1.3 ; 243.97,80.26 U2.4
TXD: length 147.2
  Top Layer w0.254: 129.67,56.63 138.05,65.01 224.9,65.01 U5.5
  Bottom Layer w0.254: 253.01,43.46 249.01,43.46 243.25,49.22 243.25,59.66 U5.5
X1A: length 104.9
  Top Layer w0.254: 20.08,49.4 25.41,54.72 30.99,54.72 31.51,55.25 31.51,56.28 34.26,59.03 v2(113.68,59.03)
  Bottom Layer w0.254: v2(113.68,59.03) 114.7,59.03 115.47,58.26 115.47,55.77 115.19,55.49 115.19,54.85 114.43,54.09
X1B: length 93.9
  Top Layer w0.254: 116.97,54.09 115.7,55.36 107.39,55.36 105.44,57.3 48.54,57.3 44.95,53.71 32.01,53.71 27.7,49.4
X1C: length 91.2
  Top Layer w0.254: 30.24,49.4 33.82,52.98 118.4,52.98 119.51,54.09
X1D: length 104.8
  Top Layer w0.254: 22.62,49.4 27.56,54.34 33.2,54.34 36.65,57.79 117.46,57.79 118.11,57.14 118.11,56.44 119.19,55.36 120.78,55.36 122.05,54.09
X2A: length 80.7
  Top Layer w0.254: v2(129.16,51.04) 99.14,51.04 95.51,47.41 57.07,47.41 55.08,49.4
  Bottom Layer w0.254: 132.21,54.09 v2(129.16,51.04)
X2B: length 74
  Top Layer w0.254: 62.7,49.4 65.92,52.62 133.28,52.62 134.75,54.09
X2C: length 74
  Top Layer w0.254: 137.29,54.09 135.29,52.09 67.93,52.09 65.24,49.4
X2D: length 85.3
  Top Layer w0.254: 139.83,54.09 137.47,51.73 98.04,51.73 94.31,47.99 59.03,47.99 57.62,49.4
X3A: length 91.4
  Top Layer w0.254: 144.91,54.09 146.18,55.36 147.96,55.36 148.72,56.12 148.72,57.89 150,59.17 219.31,59.17 229.08,49.4
X3B: length 108.3
  Top Layer w0.254: 236.7,49.4 231.43,54.67 226.37,54.67 225.27,55.77 225.27,56.38 221.09,60.57 146.43,60.57 143.64,57.77 143.64,53.45 144.53,52.57 145.92,52.57 147.45,54.09
X3C: length 92.6
  Top Layer w0.254: 149.99,54.09 154.03,50.05 155.3,50.05 157.65,47.7 237.54,47.7 239.24,49.4
X3D: length 82
  Top Layer w0.254: 152.53,54.09 158.37,48.25 230.47,48.25 231.62,49.4
X4A: length 41
  Top Layer w0.254: 194.08,49.4 192.82,50.66 158.5,50.66 155.07,54.09
X4B: length 46
  Top Layer w0.254: 201.7,49.4 198.28,52.82 158.88,52.82 157.61,54.09
X4C: length 46
  Top Layer w0.254: 160.15,54.09 199.55,54.09 204.24,49.4
X4D: length 47.7
  Top Layer w0.254: 160.15,56.63 158.88,55.36 157.1,55.36 156.46,54.72 156.46,53.33 158.7,51.09 194.93,51.09 196.62,49.4
X5A: length 21.2
  Bottom Layer w0.254: 114.43,56.63 113.16,55.36 108.08,55.36 105.92,53.2 105.92,43.56 107.08,42.4
X5B: length 15.2
  Bottom Layer w0.254: 114.7,42.4 114.7,46.97 115.74,48.01 115.74,55.4 116.97,56.63
X5C: length 15.2
  Bottom Layer w0.254: 119.51,56.63 118.36,55.49 118.36,43.53 117.24,42.4
X5D: length 23
  Top Layer w0.254: 109.62,42.4 113.69,46.47 v2(119.92,46.47)
  Bottom Layer w0.254: v2(119.92,46.47) 120.9,47.46 120.9,55.49 122.05,56.63
X6A: length 20.3
  Bottom Layer w0.254: 132.21,56.63 133.3,55.54 133.3,53.64 134.84,52.1 138.26,52.1 140.58,49.78 140.58,43.9 142.08,42.4
X6B: length 27.2
  Bottom Layer w0.254: 134.75,56.63 135.82,55.56 137.72,55.56 138.28,55 138.28,54.75 138.68,54.34 138.68,53.41 141.18,50.92 149.37,50.92 150.8,49.48 150.8,48.47 149.7,47.37 149.7,42.4
X6C: length 25
  Bottom Layer w0.254: 152.24,42.4 153.31,43.48 153.31,49.41 150.37,52.35 144.11,52.35 143.88,52.58 143.88,53.95 143.36,54.46 143.36,54.88 142.88,55.36 141.1,55.36 139.83,56.63
X6D: length 30.9
  Bottom Layer w0.254: 144.62,42.4 140.97,46.05 140.97,50.41 138.45,52.93 136.8,52.93 136.02,53.71 136.02,54.45 135.27,55.2 134.66,55.2 133.37,56.49 133.37,57.28 134.24,58.15 140.84,58.15 142.37,56.63
$1N4514: length 22.2
  Bottom Layer w0.254: 17.54,56 16.26,54.72 16.26,34.73 16.52,34.46
$1N4523: length 29.5
  Bottom Layer w0.254: 32.78,49.4 32.78,45.77 23.05,36.05 23.05,31.68 21.97,30.59 18.39,30.59 16.52,32.46
$1N4533: length 32.6
  Bottom Layer w0.254: 19.06,34.46 19.06,35.31 26.43,42.67 26.43,56.52 27.56,57.65 31.14,57.65 32.78,56
$1N4538: length 25.9
  Bottom Layer w0.254: 19.06,32.46 17.96,33.56 17.96,44.25 21.35,47.64 21.35,54.73 22.62,56
$1N4552: length 25.2
  Top Layer w0.254: 21.6,34.46 16.48,39.58 16.48,52.4 20.08,56
$1N4570: length 27.9
  Bottom Layer w0.254: 21.6,32.46 20.5,33.57 20.5,35.31 28.81,43.63 28.81,54.89 27.7,56
$1N4577: length 27.6
  Bottom Layer w0.254: 24.15,34.46 34.54,44.86 34.54,51.7 30.24,56
$1N4594: length 25.6
  Top Layer w0.254: 24.15,32.46 22.53,30.85 20.83,30.85 20.16,31.52 20.16,33 19.89,33.26 18.7,33.26 17.57,34.4 17.57,35.66 15,38.22 15,49.4
$1N4599: length 18.7
  Top Layer w0.254: 17.54,49.4 17.54,43.61 26.69,34.46
$1N4602: length 31.1
  Top Layer w0.254: 26.69,32.46 26.01,33.14 21.37,33.14 20.34,34.17 20.34,34.9 16.12,39.11 16.12,54.88 15,56
$1N4880: length 22.1
  Bottom Layer w0.254: 51.52,34.46 51.31,34.68 51.31,54.77 52.54,56
$1N4884: length 30.2
  Bottom Layer w0.254: 67.78,49.4 67.78,42.24 60.45,34.91 60.45,34.13 59.58,33.26 58.48,33.26 57.91,32.69 57.91,31.48 57.03,30.59 53.39,30.59 51.52,32.46
$1N4888: length 32.3
  Bottom Layer w0.254: 67.78,56 66.39,57.39 62.52,57.39 61.43,56.3 61.43,55.61 58.67,52.86 58.67,39.07 54.06,34.46
$1N4892: length 26.1
  Bottom Layer w0.254: 54.06,32.46 52.7,33.82 52.7,34.61 56.39,38.3 56.39,54.77 57.62,56
$1N4898: length 23.2
  Top Layer w0.254: 56.6,34.46 56.6,36.47 v2(54.23,38.85)
  Bottom Layer w0.254: 55.08,56 53.85,54.77 53.85,39.23 v2(54.23,38.85)
$1N4904: length 26.1
  Bottom Layer w0.254: 56.6,32.46 57.74,33.59 57.74,37.59 59.12,38.97 59.12,52.42 62.7,56
$1N4910: length 24.1
  Bottom Layer w0.254: 59.14,34.46 63.97,39.29 63.97,52.45 65.24,53.72 65.24,56
$1N4916: length 20.7
  Top Layer w0.254: 50,49.4 57.83,41.57 57.83,33.77 59.14,32.46
$1N4920: length 18.7
  Top Layer w0.254: 61.68,34.46 61.68,40.26 52.54,49.4
$1N4922: length 42.8
  Bottom Layer w0.254: 50,56 48.51,54.51 48.51,29.96 49.66,28.82 60.33,28.82 61.68,30.18 61.68,32.08
$1N5131: length 22.1
  Bottom Layer w0.254: 226.54,56 225.3,54.76 225.3,34.69 225.52,34.46
$1N5135: length 34.5
  Top Layer w0.254: 241.78,49.4 241.78,44.02 236.95,39.2 236.95,30.82 234.82,28.69 229.29,28.69 225.52,32.46
$1N5139: length 27.2
  Top Layer w0.254: 228.06,34.46 240.54,46.94 240.54,54.76 241.78,56
$1N5143: length 30.1
  Bottom Layer w0.254: 228.06,32.46 226.82,33.7 226.82,34.74 227.81,35.73 227.81,56.86 228.6,57.65 229.97,57.65 231.62,56
$1N5149: length 22.2
  Bottom Layer w0.254: 229.08,56 230.25,54.83 230.25,34.81 230.6,34.46
$1N5155: length 26.1
  Bottom Layer w0.254: 230.6,32.46 231.71,33.57 231.71,35.36 235.43,39.08 235.43,54.73 236.7,56
$1N5161: length 24.1
  Bottom Layer w0.254: 233.14,34.46 237.97,39.29 237.97,54.73 239.24,56
$1N5167: length 29.8
  Bottom Layer w0.254: 233.14,32.46 233.14,31.33 231.52,29.71 225.43,29.71 224,31.13 224,49.4
$1N5171: length 24.7
  Top Layer w0.254: 235.68,34.46 235.68,36.59 233.81,38.47 v2(233.81,39.23) ; v2(226.57,38.72) 228.35,40.5 v2(231.78,40.5)
  Bottom Layer w0.254: 226.54,49.4 226.54,38.75 v2(226.57,38.72) ; v2(233.81,39.23) 232.54,40.5 v2(231.78,40.5)
$1N5173: length 41.7
  Bottom Layer w0.254: 224,56 222.91,54.91 222.91,30.44 225.43,27.93 231.15,27.93 235.68,32.46
$1N5382: length 22.2
  Bottom Layer w0.254: 190.52,34.46 190.25,34.74 190.25,54.71 191.54,56
$1N5386: length 28.4
  Bottom Layer w0.254: 206.78,49.4 194.56,37.19 194.56,31.48 193.8,30.72 191.64,30.72 190.52,31.84 190.52,32.46
$1N5390: length 33.8
  Bottom Layer w0.254: 193.06,34.46 193.06,38.5 200.28,45.72 200.28,57.27 201.42,58.41 204.37,58.41 206.78,56
$1N5394: length 27
  Top Layer w0.254: v2(197.74,51.8) v2(197.74,50.15)
  Bottom Layer w0.254: v2(197.74,50.15) 197.74,47.23 191.77,41.26 191.77,33.75 193.06,32.46 ; v2(197.74,51.8) 197.74,54.88 196.62,56
$1N5400: length 24
  Top Layer w0.254: 195.6,34.46 195.6,41.62 v2(191.9,45.33)
  Bottom Layer w0.254: 194.08,56 192.97,54.89 192.97,46.4 v2(191.9,45.33)
$1N5406: length 32.3
  Bottom Layer w0.254: 195.6,32.46 196.87,33.73 196.87,35.95 208.53,47.61 208.53,50.15 202.69,56 201.7,56
$1N5412: length 28.7
  Bottom Layer w0.254: 198.14,34.46 209.8,46.12 209.8,50.44 204.24,56
$1N5418: length 30.6
  Bottom Layer w0.254: 189,49.4 189,30.7 189.99,29.71 197.36,29.71 198.14,30.49 198.14,32.46
$1N5422: length 18.7
  Top Layer w0.254: v2(191.64,47.11) 200.68,38.06 200.68,34.46
  Bottom Layer w0.254: v2(191.64,47.11) 191.54,47.21 191.54,49.4
$1N5424: length 42.2
  Bottom Layer w0.254: 189,56 187.95,54.95 187.95,30.35 189.87,28.44 198.25,28.44 200.68,30.87 200.68,32.46
$1N5633: length 15.2
  Bottom Layer w0.254: 103.52,34.46 103.25,34.73 103.25,47.71 104.54,49
$1N5637: length 22.4
  Top Layer w0.254: 103.52,32.46 104.33,33.26 114.05,33.26 114.95,34.17 114.95,37.58 119.78,42.4
$1N5641: length 29.1
  Bottom Layer w0.254: 106.06,34.46 107.11,33.41 107.11,31.56 107.82,30.85 109.09,30.85 109.95,31.71 109.95,32.7 110.52,33.26 112.01,33.26 112.42,33.66 112.42,34.93 118.74,41.26 118.74,46.08 119.38,46.72 119.38,48.6 119.78,49
$1N5645: length 18.9
  Bottom Layer w0.254: 109.62,49 108.33,47.71 108.33,41.91 104.97,38.55 104.97,33.55 106.06,32.46
$1N5651: length 20.6
  Bottom Layer w0.254: 108.6,34.46 108.6,38.64 110.71,40.75 110.71,49.81 110.24,50.28 108.36,50.28 107.08,49
$1N5657: length 19.1
  Bottom Layer w0.254: 108.6,32.46 109.85,33.71 109.85,37.3 113.28,40.73 113.28,47.58 114.7,49
$1N5663: length 17.1
  Bottom Layer w0.254: 117.24,49 116.05,47.81 116.05,39.37 111.14,34.46
$1N5669: length 21.4
  Bottom Layer w0.254: 111.14,32.46 111.14,31.63 109.6,30.09 106.17,30.09 104.79,31.47 104.79,32.64 104.17,33.26 102.62,33.26 102,33.88 102,42.4
$1N5673: length 12.4
  Top Layer w0.254: 104.54,42.4 106.66,40.28 107.87,40.28 113.68,34.46
$1N5675: length 34.9
  Bottom Layer w0.254: 102,49 100.33,47.33 100.33,30.85 102.74,28.44 109.66,28.44 113.68,32.46
$1N5884: length 15.1
  Bottom Layer w0.254: 139.54,49 138.3,47.76 138.3,34.68 138.52,34.46
$1N5888: length 26.3
  Bottom Layer w0.254: 154.78,42.4 154.78,40.44 149.95,35.61 149.95,33.86 149.35,33.26 147.92,33.26 147.57,32.91 147.57,31.61 145.54,29.58 140.34,29.58 138.52,31.39 138.52,32.46
$1N5892: length 29.7
  Bottom Layer w0.254: 154.78,49 154.78,44.23 153.51,42.96 153.51,40.79 147.29,34.57 147.29,33.61 146.94,33.26 145.16,33.26 144.87,32.97 144.87,31.07 144.65,30.85 142.62,30.85 142.33,31.14 142.33,33.19 141.06,34.46
$1N5896: length 19.8
  Bottom Layer w0.254: 141.06,32.46 140.02,33.51 140.02,35.68 145.68,41.34 145.68,47.94 144.62,49
$1N5902: length 20.8
  Bottom Layer w0.254: 143.6,34.46 143.6,38.41 146.03,40.84 146.03,49.41 145.16,50.28 143.36,50.28 142.08,49
$1N5908: length 19.1
  Bottom Layer w0.254: 149.7,49 148.43,47.73 148.43,40.74 144.87,37.18 144.87,33.73 143.6,32.46
$1N5914: length 17.1
  Bottom Layer w0.254: 152.24,49 151.12,47.87 151.12,39.43 146.14,34.46
$1N5920: length 13.9
  Top Layer w0.254: 137,42.4 137.26,42.4 144.87,34.79 144.87,33.73 146.14,32.46
$1N5924: length 12.4
  Top Layer w0.254: 139.54,42.4 141.66,40.28 142.87,40.28 148.68,34.46
$1N5926: length 38.2
  Bottom Layer w0.254: 148.3,32.37 148.3,31.57 145.42,28.69 133.73,28.69 133.73,45.73 137,49
$1N6405: length 16.7
  Bottom Layer w1: 29.23,32.46 31.62,30.06 31.62,20.16 R1.1
$1N6464: length 6.9
  Bottom Layer w1: 64.22,32.46 64.22,26.97 63.25,26
$1N6515: length 4.2
  Bottom Layer w1: R3.1 238.22,28.28 238.22,32.46
$1N6566: length 4.3
  Bottom Layer w1: 203.22,32.46 203.22,28.35 R4.1
$1N6696: length 4.3
  Bottom Layer w1: 116.22,32.46 116.22,28.36 R5.1
$1N6744: length 14.5
  Bottom Layer w1: 139.75,26 145.14,26 151.6,32.46
$1N7322: length 16.6
  Bottom Layer w1: 9.91,75.97 15.1,70.78 SW1.1
$1N11180: length 16.5
  Bottom Layer w0.254: BUZ1.2 92.46,61.03 92.46,66.28 93.22,67.04 96.42,67.04
$1N11187: length 5.1
  Bottom Layer w0.254: Q1.1 95.55,66.09 96.95,64.69 96.95,63.87 97.78,63.87
$1N11430: length 10.5
  Bottom Layer w1: H1.3 87.54,44.73 86.27,46
$1N11434: length 10.5
  Bottom Layer w1: H2.3 174.54,44.73 173.27,46
$1N11486: length 35.8
  Bottom Layer w1: H2.1 168.42,36 160.91,28.49 149.66,28.49 142.17,21 R9.2
$1N11490: length 25.5
  Bottom Layer w1: R8.2 66.42,21 81.42,36 H1.1
$1N11585: length 7
  Bottom Layer w0.254: R11.2 85,46
$1N11588: length 7
  Bottom Layer w0.254: R10.2 Q3.2
$1N11682: length 37.8
  Bottom Layer w1: SW1.2 32.12,77.78 33.15,78.81 ; H3.1 33.15,78.81 ; 33.15,78.81 44.43,67.53
$1N11688: length 16.3
  Bottom Layer w1: 41.88,77.65 35.69,83.84 H3.2
$1N11859: length 3.6
  Top Layer w0.254: R12.1 230.98,77 U5.7
$1N11862: length 4.1
  Top Layer w0.254: U5.6 230.65,74.05 229,72.39 228,72.39
$1N17522: length 19
  Bottom Layer w0.254: DS1.8 194,73.14 190.37,73.14 190.37,67.68 H5.1 H5.2

## Copper pours and planes (outline as drawn; the poured copper is in the pictures)
+5V on Top Layer: 0.25,95.37 256.16,95.37 256.16,0.88 0.25,0.88
GND on Bottom Layer: 0.38,95.37 256.11,95.37 256.11,0.37 0.38,0.37

## Text on the board
Bottom Silkscreen Layer: JLCJLCJLCJLC | 2024-07-03 | 升压跳线帽 | 学无止境，气有浩然 | 刘子谦设计 | 北京化工大学工程训练中心 / 竞赛社竞赛部 / 机械创客中心
Top Silkscreen Layer: C8 C6 D14 D12 GND +5 | D10 | D8 | G CL DA TX RX | 解码端口 | 机电工程学院 / 信息科学与技术学院 | 电源
